# EAGLE design frutir (EAGLE 9.6.2)
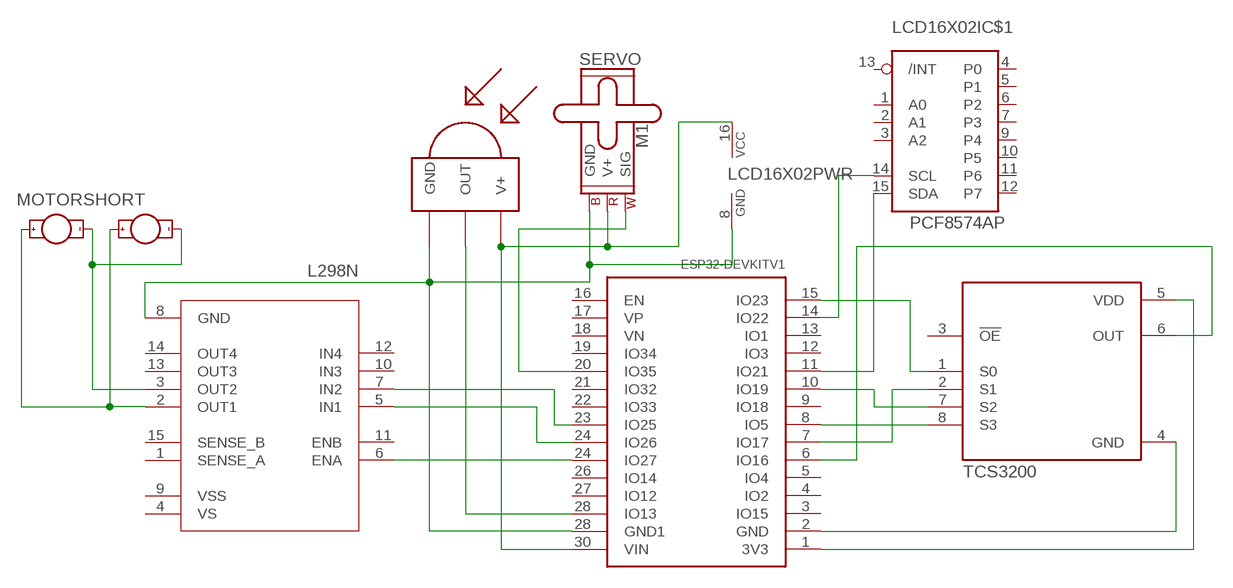
[diagram p0: schematic, sheet 1]

## Parts
LCD16X02  PCF8574AP  [DIL16]
M1  SERVO  [1X03]
M2  MOTORSHORT  [VIBE-MOTOR-10MM-SMD]
M3  MOTORSHORT  [VIBE-MOTOR-10MM-SMD]
U1  TCS3200  [SOIC127P600X175-8N]
U2  L298N  [TO127P2020X500X2100-15]
U$1  ESP32DEVKITV1  [ESP32-DEVKITV1]
U$2  TSOP1830  [TSOP18XX]

## Nets
N$1: U1.1(S0) U$1.15(IO23)
N$2: U1.2(S1) U$1.7(IO17)
N$3: U1.7(S2) U$1.10(IO19)
N$4: U1.8(S3) U$1.8(IO5)
N$5: U1.6(OUT) U$1.6(IO16)
N$6: U1.5(VDD) U$1.1(3V3)
N$7: U1.4(GND) U$1.2(GND)
N$8: LCD16X02.8(PWR:GND) M1.3(GND) U2.8(GND) U$1.28(GND1) U$2.GND
N$9: LCD16X02.16(PWR:VCC) M1.2(V+) U$1.30(VIN) U$2.VCC(V+)
N$10: U$1.28(IO13) U$2.OUT
N$11: U2.6(ENA) U$1.24(IO27)
N$12: U2.5(IN1) U$1.24(IO26)
N$13: U2.7(IN2) U$1.23(IO25)
N$14: M2.+ M3.+ U2.2(OUT1)
N$15: M2.- M3.- U2.3(OUT2)
N$16: M1.1(SIG) U$1.20(IO35)
N$17: LCD16X02.15(IC$1:SDA) U$1.11(IO21)
N$18: LCD16X02.14(IC$1:SCL) U$1.14(IO22)
Unconnected: LCD16X02.1(IC$1:A0) LCD16X02.2(IC$1:A1) LCD16X02.3(IC$1:A2) LCD16X02.4(IC$1:P0) LCD16X02.5(IC$1:P1) LCD16X02.6(IC$1:P2) LCD16X02.7(IC$1:P3) LCD16X02.9(IC$1:P4) LCD16X02.10(IC$1:P5) LCD16X02.11(IC$1:P6) LCD16X02.12(IC$1:P7) LCD16X02.13(IC$1:/INT) U1.3(!OE) U2.1(SENSE_A) U2.9(VSS) U2.10(IN3) U2.11(ENB) U2.12(IN4) U2.13(OUT3) U2.14(OUT4) U2.15(SENSE_B) U$1.3(IO15) U$1.4(IO2) U$1.5(IO4) U$1.9(IO18) U$1.12(IO3) U$1.13(IO1) U$1.16(EN) U$1.17(VP) U$1.18(VN) U$1.19(IO34) U$1.21(IO32) U$1.22(IO33) U$1.26(IO14) U$1.27(IO12)

## Power pins joined to a net without a drawn wire
VS: U2.4(VS)

## Library data of the parts
LCD16X02 = i2c:PCF8574: Remote 8-Bit I/O Expander for I²C Bus
M1 = SparkFun-Electromechanical:SERVO: Servo Motor 3-pin connector for a standard servo motor (voltage supply, ground, and control signal.) SparkFun Products Servo - Generic (Sub-Micro Size) <https://www.sparkfun.com/products/9065> (ROB-09065) Servo - Generic High Torque Continuous Rotation (Standard Size) <https://www.sparkfun.com/products/9347> (ROB-09347) Servo - Generic High Torque (Standard Size) <https://www.sparkfun.com/products/11965> (ROB-11965)
M2 M3 = SparkFun-Electromechanical:MOTOR: Motor (Single-Phase) Two-terminal, single-phase motors. SparkFun Products Vibration Motor <https://www.sparkfun.com/products/8449> (ROB-08449) Physical dimension and wire connections for this powerful vibration motor. Motor has a self adhesive backing.; PROD_ID: COMP-13709
U1 = TCS3200:TCS3200: Color Sensor Auto Power Down 8-SOIC (0.154in, 3.90mm Width) Check prices <https://pricing.snapeda.com/parts/TCS3200/ams/view-part?ref=eda> Check prices <https://pricing.snapeda.com/parts/TCS3200/ams/view-part?ref=eda> Check availability <https://pricing.snapeda.com/parts/TCS3200/ams/view-part?ref=eda>; AVAILABILITY: Not in stock; DESCRIPTION: Light to Frequency Ambient Light Sensor Digital 5V 8-Pin SOIC T/R; MF: ams; MP: TCS3200; PACKAGE: SOIC-8 ams; PRICE: None
U2 = L298N:L298N: Dual Full Bridge Motor Driver 15-Pin(15+Tab) MULTIWATT V Tube Check availability <https://pricing.snapeda.com/parts/L298N/STMicroelectronics/view-part?ref=eda>; AVAILABILITY: In Stock; DESCRIPTION: Half Bridge (4) Driver DC Motors, Relays, Solenoids, Stepper Motors Bipolar 15-Multiwatt; MF: STMicroelectronics; MP: L298N; PACKAGE: Multiwatt-15 STMicroelectronics; PRICE: None; PURCHASE-URL: https://pricing.snapeda.com/search/part/L298N/?ref=eda
U$1 = ESP32-DEVKITV1:ESP32DEVKITV1
U$2 = tsop:TSOP1830: IR Receiver and Demodulator

## Board
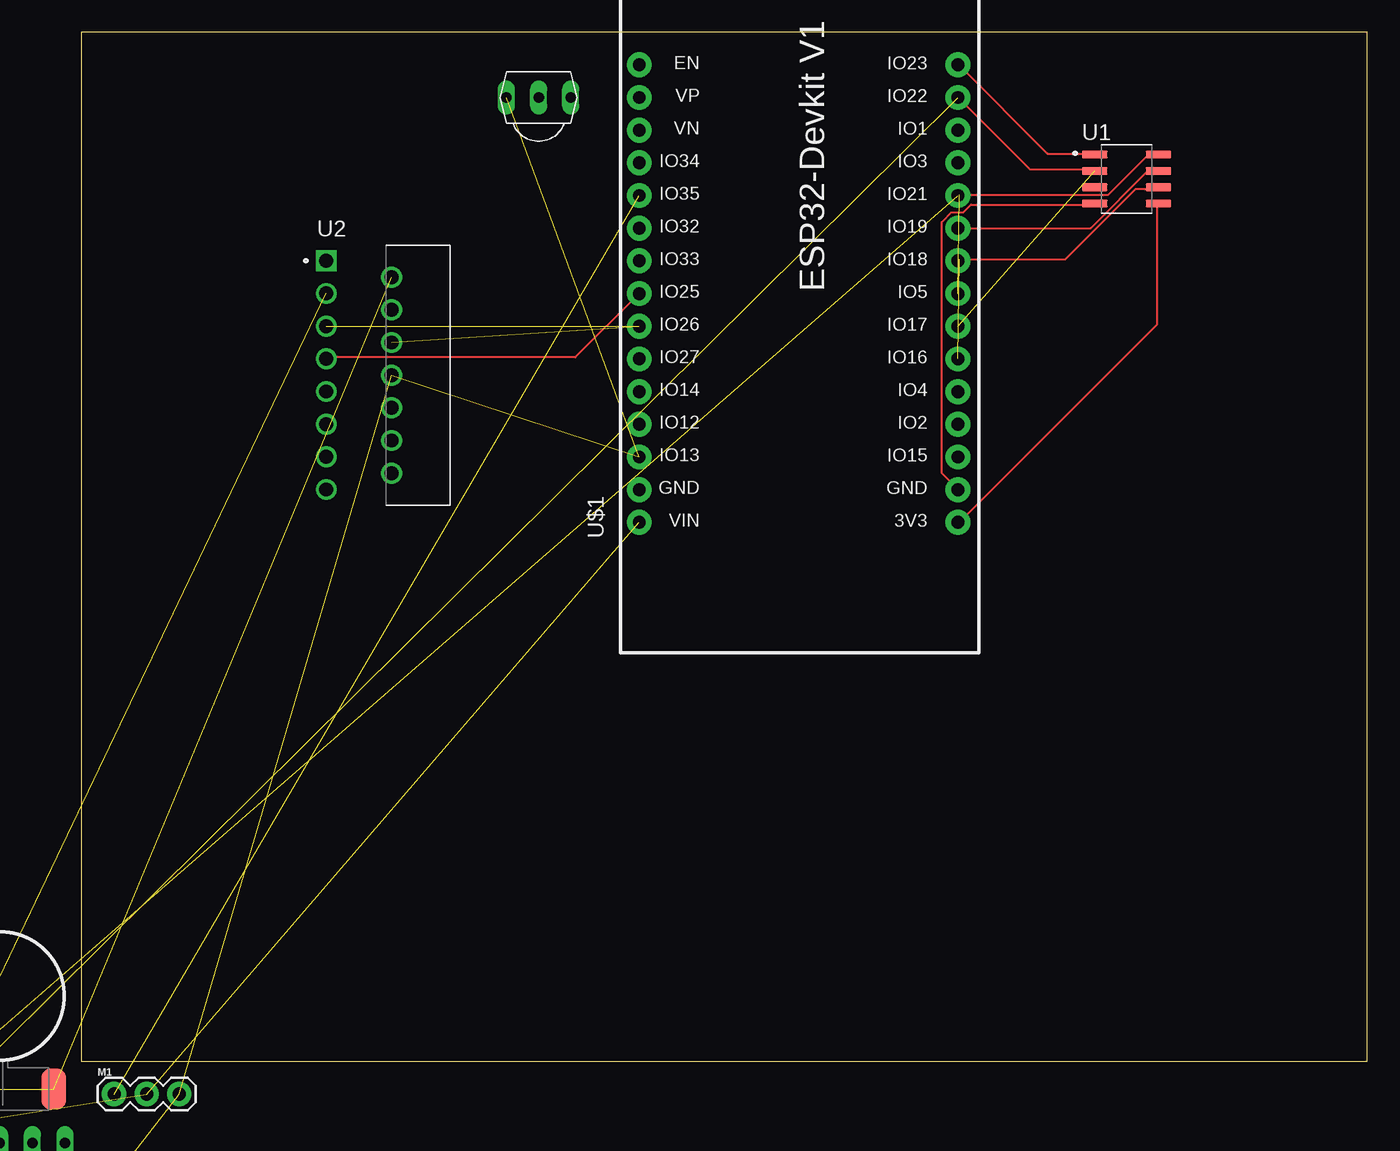
[diagram p1: board, top side]
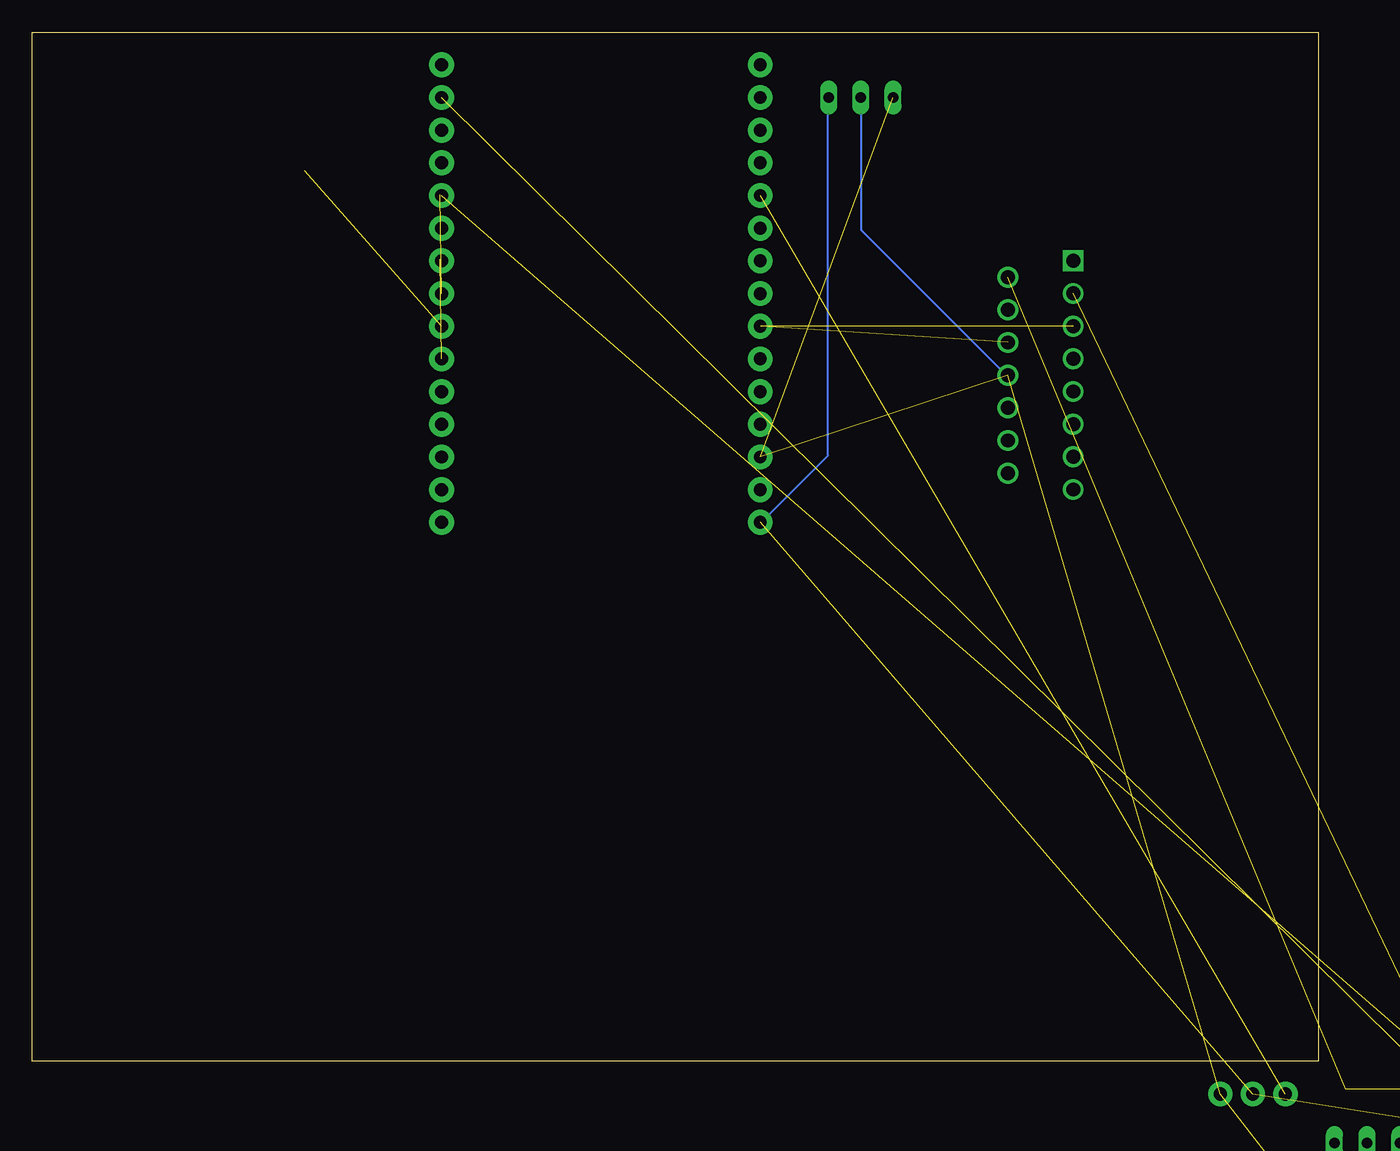
[diagram p2: board, bottom side, seen from below]

Size 100 x 80 mm. Coordinates in mm from the lower left corner, seen from the top.
Outline: 0,0 100,0 100,80 0,80 0,0
Copper layers (1*16): Top 0.035mm / dielectric 1.5mm / Bottom 0.035mm
Design rules "default": minimum track width 6mil, minimum drill 0.35mm, track to track 6mil, track to pad 6mil, pad to pad 6mil, via to via 6mil, smd to smd 6mil, copper to edge 40mil, drill to drill 6mil, minimum pad ring 10mil, minimum via ring 8mil, stop-mask expansion 4mil, vias tented up to drill 0mil, thermal gap 10mil

### Footprints (pad centres in the part's own frame; a part is rotated, then mirrored left to right if it is on the bottom)
DIL16 = drill 0.813 long: 1 -8.89,-3.81; 2 -6.35,-3.81; 3 -3.81,-3.81; 4 -1.27,-3.81; 5 1.27,-3.81; 6 3.81,-3.81; 7 6.35,-3.81; 8 8.89,-3.81; 9 8.89,3.81; 10 6.35,3.81; 11 3.81,3.81; 12 1.27,3.81; 13 -1.27,3.81; 14 -3.81,3.81; 15 -6.35,3.81; 16 -8.89,3.81
1X03 = drill 1.016 pad 1.88: 1 0,0; 2 2.54,0; 3 5.08,0
VIBE-MOTOR-10MM-SMD = smd 1.905 x 3.175: + 4.191,-7.239; - -4.191,-7.239
SOIC127P600X175-8N = smd 1.97 x 0.6: 1 -2.475,1.905; 2 -2.475,0.635; 3 -2.475,-0.635; 4 -2.475,-1.905; 5 2.475,-1.905; 6 2.475,-0.635; 7 2.475,0.635; 8 2.475,1.905
TO127P2020X500X2100-15 = drill 1.08 pad 1.62 square: 1 0,0 | drill 1.08 pad 1.62: 2 5.08,-1.27; 3 0,-2.54; 4 5.08,-3.81; 5 0,-5.08; 6 5.08,-6.35; 7 0,-7.62; 8 5.08,-8.89; 9 0,-10.16; 10 5.08,-11.43; 11 0,-12.7; 12 5.08,-13.97; 13 0,-15.24; 14 5.08,-16.51; 15 0,-17.78
ESP32-DEVKITV1 = drill 1 pad 1.93: 1 -22.87,-13.54; 2 -20.33,-13.54; 3 -17.79,-13.54; 4 -15.25,-13.54; 5 -12.71,-13.54; 6 -10.17,-13.54; 7 -7.63,-13.54; 8 -5.09,-13.54; 9 -2.55,-13.54; 10 -0.01,-13.54; 11 2.53,-13.54; 12 5.07,-13.54; 13 7.61,-13.54; 14 10.15,-13.54; 15 12.69,-13.54; 16 12.69,11.23; 17 10.15,11.23; 18 7.61,11.23; 19 5.07,11.23; 20 2.53,11.23; 21 -0.01,11.23; 22 -2.55,11.23; 23 -5.09,11.23; 24 -7.63,11.23; 25 -10.17,11.23; 26 -12.71,11.23; 27 -15.25,11.23; 28 -17.79,11.23; 29 -20.33,11.23; 30 -22.87,11.23
TSOP18XX = drill 0.813 long: GND -0.001,-0.027; OUT -2.501,-0.027; VCC 2.499,-0.027

### Placement (x,y rotation side)
LCD16X02  -10.16,-10.16 0 top  (outside the outline)
M1  2.54,-2.54 0 top
M2  -6.35,5.08 0 top
M3  -17.78,5.08 0 top  (outside the outline)
U1  81.28,68.58 0 top
U2  19.05,62.23 0 top
U$1  54.61,64.77 90 top
U$2  35.56,74.93 0 top

### Tracks (layer width: path | path; a pad name or v marks a point on that pad's centre or on a via)
N$1
  Top 0.152: U1.1 78.79,70.56 75.13,70.56 68.28,77.42 U$1.15
N$2  (1 unrouted)
  Top 0.152: 68.28,74.83 73.76,69.34 78.79,69.34 U1.2
N$3
  Top 0.152: U1.7 83.67,69.19 82.91,69.19 78.49,64.77 68.28,64.77 U$1.10
N$4  (1 unrouted)
  Top 0.152: 68.28,67.36 79.86,67.36 82.91,70.41 83.67,70.41 U1.8
N$5  (1 unrouted)
  Top 0.152: 68.28,62.33 76.5,62.33 81.99,67.82 83.67,67.82 U1.6
N$6
  Top 0.152: U1.5 83.67,66.6 83.67,57.3 68.28,41.91 U$1.1
N$7
  Top 0.152: U1.4 78.79,66.6 69.19,66.6 68.58,65.99 67.67,65.99 66.9,65.23 66.9,45.72 68.12,44.5 U$1.2
N$8  (3 unrouted)
  Bottom 0.152: U$2.GND 35.51,74.83 35.51,64.62 24.23,53.34 U2.8
N$9  (2 unrouted)
  Bottom 0.152: U$2.VCC 38.1,74.83 38.1,47.09 43.28,41.91 U$1.30
N$10  (1 unrouted)
N$11  (1 unrouted)
N$12  (1 unrouted)
N$13
  Top 0.152: U2.7 19.05,54.71 38.41,54.71 43.28,59.59 U$1.23
N$14  (2 unrouted)
N$15  (2 unrouted)
N$16  (1 unrouted)
N$17  (1 unrouted)
N$18  (1 unrouted)